# Altium project MC3_r2.PrjPcb (part 9 of 10)

## Sheet CanFaults.SchDoc
size Letter; Organization: Altium Limited; Address1: L3, 12a Rodborough Rd; Address2: Frenchs Forest; Address3: NSW; Address4: Australia 2086; DocumentNumber: D_3; SheetNumber: 3; SheetTotal: 21
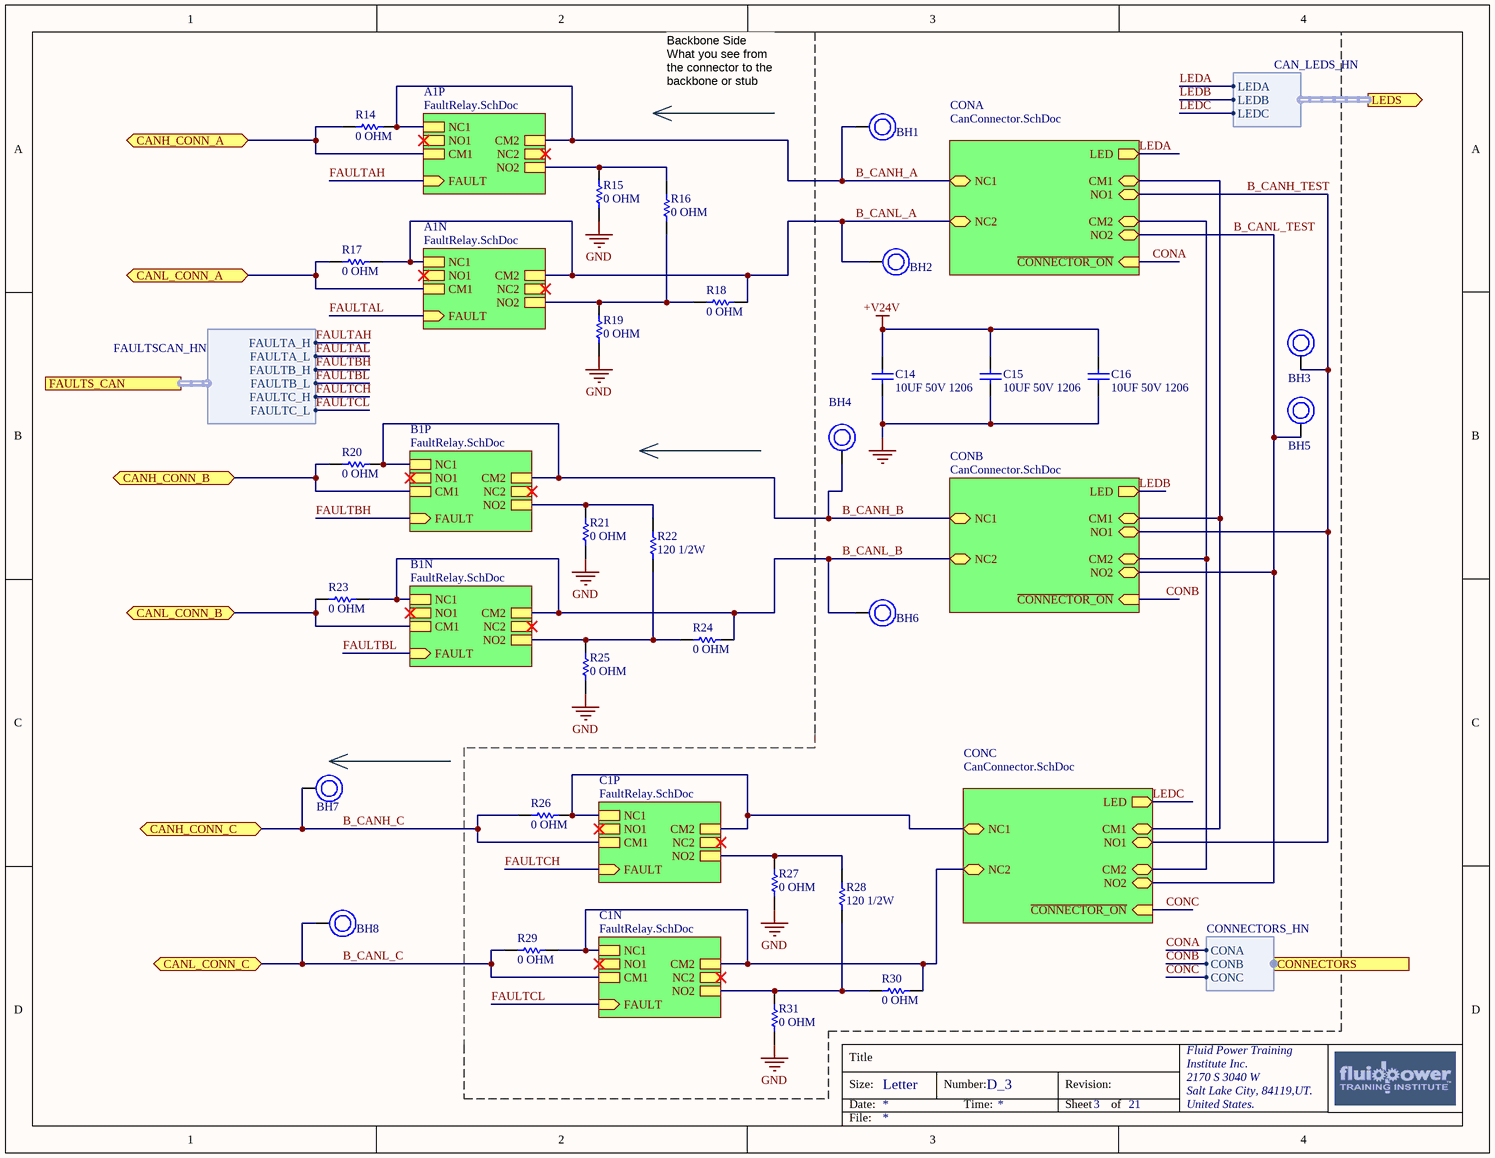
[diagram p15: CanFaults.SchDoc]

### Parts
BH1  BananaHole  [BananaHole]  (value not drawn)  (no BOM)
BH2  BananaHole  [BananaHole]  (value not drawn)  (no BOM)
BH3  BananaHole  [BananaHole]  (value not drawn)  (no BOM)
BH4  BananaHole  [BananaHole]  (value not drawn)  (no BOM)
BH5  BananaHole  [BananaHole]  (value not drawn)  (no BOM)
BH6  BananaHole  [BananaHole]  (value not drawn)  (no BOM)
BH7  BananaHole  [BananaHole]  (value not drawn)  (no BOM)
BH8  BananaHole  [BananaHole]  (value not drawn)  (no BOM)
C14  10UF 50V 1206  [CAPC3216X180X20ML20]
C15  10UF 50V 1206  [CAPC3216X180X20ML20]
C16  10UF 50V 1206  [CAPC3216X180X20ML20]
R14  0 OHM  [R0805]
R15  0 OHM  [R0805]
R16  0 OHM  [R0805]
R17  0 OHM  [R0805]
R18  0 OHM  [R0805]
R19  0 OHM  [R0805]
R20  0 OHM  [R0805]
R21  0 OHM  [R0805]
R22  120 1/2W  [RESC3225X60X45NL20T20]
R23  0 OHM  [R0805]
R24  0 OHM  [R0805]
R25  0 OHM  [R0805]
R26  0 OHM  [R0805]
R27  0 OHM  [R0805]
R28  120 1/2W  [RESC3225X60X45NL20T20]
R29  0 OHM  [R0805]
R30  0 OHM  [R0805]
R31  0 OHM  [R0805]

### Sub-sheets
A1N = FaultRelay.SchDoc: NC2, NO1, NC1, FAULT (in), NO2, CM1, CM2
A1P = FaultRelay.SchDoc: NC2, NO1, NC1, FAULT (in), NO2, CM1, CM2
B1N = FaultRelay.SchDoc: NC2, NO1, NC1, FAULT (in), NO2, CM1, CM2
B1P = FaultRelay.SchDoc: NC2, NO1, NC1, FAULT (in), NO2, CM1, CM2
C1N = FaultRelay.SchDoc: NC2, NO1, NC1, FAULT (in), NO2, CM1, CM2
C1P = FaultRelay.SchDoc: NC2, NO1, NC1, FAULT (in), NO2, CM1, CM2
CONA = CanConnector.SchDoc: CM2 (bidir), CM1 (bidir), NO2 (bidir), NO1 (bidir), NC2 (bidir), NC1 (bidir), ~{CONNECTOR_ON} (in), LED (out)
CONB = CanConnector.SchDoc: CM2 (bidir), CM1 (bidir), NO2 (bidir), NO1 (bidir), NC2 (bidir), NC1 (bidir), ~{CONNECTOR_ON} (in), LED (out)
CONC = CanConnector.SchDoc: CM2 (bidir), CM1 (bidir), NO2 (bidir), NO1 (bidir), NC2 (bidir), NC1 (bidir), ~{CONNECTOR_ON} (in), LED (out)

### Ports
CANH_CONN_A (bidir), CANH_CONN_B (bidir), CANH_CONN_C (bidir), CANL_CONN_A (bidir), CANL_CONN_B (bidir), CANL_CONN_C (bidir), CONNECTORS (harness CONNECTORS_HN), FAULTS_CAN (harness FAULTSCAN_HN), LEDS (out, harness CAN_LEDS_HN)

### Harnesses
FAULTSCAN_HN: FAULTA_H, FAULTA_L, FAULTB_H, FAULTB_L, FAULTC_H, FAULTC_L
CONNECTORS_HN: CONA, CONB, CONC
CAN_LEDS_HN: LEDA, LEDB, LEDC

### Nets
+V24V: C14.2 C15.2 C16.2
GND: C14.1 C15.1 C16.1 R15.1 R19.1 R21.1 R25.1 R27.1 R31.1
B_CANH_A: BH1.1 R14.2 ; sheet A1P/NC1, sheet A1P/CM2, sheet CONA/NC1
B_CANH_B: BH4.1 R20.2 ; sheet B1P/NC1, sheet B1P/CM2, sheet CONB/NC1
B_CANH_C: BH7.1 R26.1 ; port CANH_CONN_C, sheet C1P/CM1  [project net MC2_MC3_CANH]
B_CANH_TEST: BH3.1 ; sheet CONA/NO1, sheet CONB/NO1, sheet CONC/NO1
B_CANL_A: BH2.1 R17.2 R18.1 ; sheet A1N/NC1, sheet A1N/CM2, sheet CONA/NC2
B_CANL_B: BH6.1 R23.2 R24.1 ; sheet B1N/NC1, sheet B1N/CM2, sheet CONB/NC2
B_CANL_C: BH8.1 R29.1 ; port CANL_CONN_C, sheet C1N/CM1  [project net MC2_MC3_CANL]
B_CANL_TEST: BH5.1 ; sheet CONA/NO2, sheet CONB/NO2, sheet CONC/NO2
CONA: sheet CONA/~{CONNECTOR_ON}, port CONNECTORS.CONA
CONB: sheet CONB/~{CONNECTOR_ON}, port CONNECTORS.CONB
CONC: sheet CONC/~{CONNECTOR_ON}, port CONNECTORS.CONC
FAULTAH: sheet A1P/FAULT, port FAULTS_CAN.FAULTA_H
FAULTAL: sheet A1N/FAULT, port FAULTS_CAN.FAULTA_L
FAULTBH: sheet B1P/FAULT, port FAULTS_CAN.FAULTB_H
FAULTBL: sheet B1N/FAULT, port FAULTS_CAN.FAULTB_L
FAULTCH: sheet C1P/FAULT, port FAULTS_CAN.FAULTC_H
FAULTCL: sheet C1N/FAULT, port FAULTS_CAN.FAULTC_L
LEDA: sheet CONA/LED, port LEDS.LEDA
LEDB: sheet CONB/LED, port LEDS.LEDB
LEDC: sheet CONC/LED, port LEDS.LEDC
TESTCONNECTOR_CANH: R14.1 ; port CANH_CONN_A, sheet A1P/CM1
TESTCONNECTOR_CANL: R17.1 ; port CANL_CONN_A, sheet A1N/CM1
NetBH35_1: R20.1 ; port CANH_CONN_B, sheet B1P/CM1
NetBH39_1: R23.1 ; port CANL_CONN_B, sheet B1N/CM1
NetR15_2: R15.2 R16.2 ; sheet A1P/NO2
NetR16_1: R16.1 R18.2 R19.2 ; sheet A1N/NO2
NetR21_2: R21.2 R22.2 ; sheet B1P/NO2
NetR22_1: R22.1 R24.2 R25.2 ; sheet B1N/NO2
NetR26_2: R26.2 ; sheet C1P/NC1, sheet C1P/CM2, sheet CONC/NC1
NetR27_2: R27.2 R28.2 ; sheet C1P/NO2
NetR28_1: R28.1 R30.2 R31.2 ; sheet C1N/NO2
NetR29_2: R29.2 R30.1 ; sheet C1N/NC1, sheet C1N/CM2, sheet CONC/NC2
NetRL1_CONA_3: sheet CONA/CM1, sheet CONB/CM1, sheet CONC/CM1
NetRL1_CONA_6: sheet CONA/CM2, sheet CONB/CM2, sheet CONC/CM2

### Notes on the sheet
- Backbone Side
  What you see from the connector to the backbone or stub
- Title
- Size:
- Date:
- Letter
- Number:
- Time:
- Revision:
- Sheet
- of
- Fluid Power Training
- Institute Inc.
- 2170 S 3040 W
- Salt Lake City, 84119,UT.
- United States.
- File:

### Library data of the parts
BH1-BH8 = BananaHole: as BH9-BH32 on sheet MC_Connector
C14-C16 = C3216X5R1H106K160AB: CAP CER 10UF 50V X5R 1206; Manufacturer: TDK; Dielectric Material: Ceramic; Tolerance: 10%; Supplier 1: Mouser; Supplier Part Number 1: 810-C3216X5R1H106K; Manufacturer Part Number: C3216X5R1H106K160AB; RoHS: Yes; Category: Ceramic Capacitors; Stock 1: 145018; Pricing 1: 1=0.88000, 10=0.73100, 100=0.51800, 500=0.40900, 1000=0.35200, 2000=0.28700 (USD); Mount: Surface Mount; Case/Package: 1206; Weight: 0.000571oz; Case Code (Metric): 3216; Case Code (Imperial): 1206; Min Operating Temperature: -55°C; Max Operating Temperature: 85°C; Packaging: Tape and Reel; Capacitance: 10uF; Voltage Rating (DC): 50V; Dielectric: X5R; Package Quantity: 1; Voltage Rating: 50V; Termination: SMD/SMT; Voltage: 50V; Composition: Ceramic; Length: 3.2mm; Height: 1.6mm; Width: 0.063inch; Thickness: 0.071inch; Depth: 1.6mm; Radiation Hardening: No; REACH SVHC: No SVHC; Lead Free: Lead Free; ComponentLink1URL: https://datasheet.ciiva.com/24216/c3216x5r1h106k160ab-265364-24216574.pdf?src-supplier=Mouser; ComponentLink1Description: https://datasheet.ciiva.com/24216/c3216x5r1h106k160ab-265364-24216574.pdf?src-supplier=Mouser; ComponentLink2URL: https://datasheet.ciiva.com/6285/tdkmlcccaprange-6285895.pdf?src-supplier=Digi-Key; ComponentLink2Description: https://datasheet.ciiva.com/6285/tdkmlcccaprange-6285895.pdf?src-supplier=Digi-Key; ComponentLink3URL: https://datasheet.ciiva.com/24365/1865c3216x5r1h106k160ab-24365495.pdf?src-supplier=Onlinecomponents.com; ComponentLink3Description: https://datasheet.ciiva.com/24365/1865c3216x5r1h106k160ab-24365495.pdf?src-supplier=Onlinecomponents.com; ComponentLink4URL: https://datasheet.ciiva.com/22719/1796654-22719560.pdf?src-supplier=Element14; ComponentLink4Description: https://datasheet.ciiva.com/22719/1796654-22719560.pdf?src-supplier=Element14; ComponentLink5URL: https://datasheet.ciiva.com/28659/mlcc-commercial-general-en-28659437.pdf?src-supplier=Element14; ComponentLink5Description: https://datasheet.ciiva.com/28659/mlcc-commercial-general-en-28659437.pdf?src-supplier=Element14; ComponentLink6URL: https://datasheet.ciiva.com/17487/e412-c-17487294.pdf?src-supplier=Avnet+Europe; ComponentLink6Description: https://datasheet.ciiva.com/17487/e412-c-17487294.pdf?src-supplier=Avnet+Europe; ComponentLink7URL: https://datasheet.ciiva.com/6285/tdkmlcccaprange-6285893.pdf?src-supplier=Digi-Key; ComponentLink7Description: https://datasheet.ciiva.com/6285/tdkmlcccaprange-6285893.pdf?src-supplier=Digi-Key; ComponentLink8URL: https://datasheet.ciiva.com/22725/1913358-22725589.pdf?src-supplier=Element14; ComponentLink8Description: https://datasheet.ciiva.com/22725/1913358-22725589.pdf?src-supplier=Element14; ComponentLink9URL: https://datasheet.ciiva.com/23803/1796654-23803045.pdf?src-supplier=Newark; ComponentLink9Description: https://datasheet.ciiva.com/23803/1796654-23803045.pdf?src-supplier=Newark; ComponentLink10URL: https://datasheet.ciiva.com/28452/1796654-28452010.pdf?src-supplier=Element14; ComponentLink10Description: https://datasheet.ciiva.com/28452/1796654-28452010.pdf?src-supplier=Element14
R14 R15 R17-R21 R23-R27 R29-R31 = RK73Z2ATTD: Res Thick Film 0805 0 Ohm Pad SMD Automotive T/R; Manufacturer: KOA Speer; Resistance: 0mR; Tolerance: 1%; Power Rating: 2W; Temperature Coefficient: 400ppm/°C; Supplier 1: Mouser; Supplier Part Number 1: 660-RK73Z2ATTD; Manufacturer Part Number: RK73Z2ATTD; RoHS: Yes; Category: Chip SMD Resistors; Stock 1: 381276; Pricing 1: 1=0.10000, 10=0.09500, 100=0.09500, 1000=0.09500, 5000=0.00500, 10000=0.00400 (USD); Case/Package: 0805; Case Code (Imperial): 0805; Case Code (Metric): 2012; Min Operating Temperature: -55°C; Max Operating Temperature: 155°C; Packaging: Tape and Reel; Composition: Thick Film; Package Quantity: 5000; Termination: SMD/SMT; Military Standard: Not; Length: 2mm; Height: 0.5mm; Width: 1.25mm; Depth: 1.25mm; Lead Free: Lead Free; REACH SVHC: Unknown; ComponentLink1URL: https://datasheet.ciiva.com/7816/549012-7816885.pdf?src-supplier=Element14; ComponentLink1Description: https://datasheet.ciiva.com/7816/549012-7816885.pdf?src-supplier=Element14; ComponentLink2URL: https://datasheet.ciiva.com/15159/getdatasheetpartid-91633-15159914.pdf?src-supplier=Verical; ComponentLink2Description: https://datasheet.ciiva.com/15159/getdatasheetpartid-91633-15159914.pdf?src-supplier=Verical; ComponentLink3URL: https://datasheet.ciiva.com/48463/rk73z-series-eng-jap-tds-48463436.pdf?src-supplier=Distrelec; ComponentLink3Description: https://datasheet.ciiva.com/48463/rk73z-series-eng-jap-tds-48463436.pdf?src-supplier=Distrelec
R16 = RK73Z2ATTD: Res Thick Film 0805 0 Ohm Pad SMD Automotive T/R; Manufacturer: KOA Speer; Resistance: 0mR; Tolerance: 1%; Temperature Coefficient: 400ppm/°C; Power Rating: 2W; Supplier 1: Mouser; Supplier Part Number 1: 660-RK73Z2ATTD; Manufacturer Part Number: RK73Z2ATTD; RoHS: Yes; Category: Chip SMD Resistors; Stock 1: 381276; Pricing 1: 1=0.10000, 10=0.09500, 100=0.09500, 1000=0.09500, 5000=0.00500, 10000=0.00400 (USD); Case/Package: 0805; Case Code (Metric): 2012; Case Code (Imperial): 0805; Min Operating Temperature: -55°C; Max Operating Temperature: 155°C; Packaging: Tape and Reel; Package Quantity: 5000; Composition: Thick Film; Termination: SMD/SMT; Military Standard: Not; Length: 2mm; Height: 0.5mm; Width: 1.25mm; Depth: 1.25mm; Lead Free: Lead Free; REACH SVHC: Unknown; ComponentLink1URL: https://datasheet.ciiva.com/7816/549012-7816885.pdf?src-supplier=Element14; ComponentLink1Description: https://datasheet.ciiva.com/7816/549012-7816885.pdf?src-supplier=Element14; ComponentLink2URL: https://datasheet.ciiva.com/15159/getdatasheetpartid-91633-15159914.pdf?src-supplier=Verical; ComponentLink2Description: https://datasheet.ciiva.com/15159/getdatasheetpartid-91633-15159914.pdf?src-supplier=Verical; ComponentLink3URL: https://datasheet.ciiva.com/48463/rk73z-series-eng-jap-tds-48463436.pdf?src-supplier=Distrelec; ComponentLink3Description: https://datasheet.ciiva.com/48463/rk73z-series-eng-jap-tds-48463436.pdf?src-supplier=Distrelec
R22 R28 = CRCW1210120RFKEA: Thick Film Resistors - SMD 1/2watt 120ohms 1%; Manufacturer: Vishay; Resistance: 120R; Temperature Coefficient: 100ppm/°C; Power Rating: 500mW; Voltage Rating: 200V; Supplier 1: Mouser; Supplier Part Number 1: 71-CRCW1210F-120-E3; Manufacturer Part Number: CRCW1210120RFKEA; RoHS: Yes; Category: Chip SMD Resistors; Stock 1: 16273; Pricing 1: 1=0.25000, 10=0.21500, 100=0.08400, 1000=0.03200, 5000=0.02600, 10000=0.02400 (USD); Case/Package: 1210; Weight: 0.000564oz; Case Code (Metric): 3225; Case Code (Imperial): 1210; Contact Plating: Tin; Min Operating Temperature: -55°C; Max Operating Temperature: 155°C; Tolerance: 1%; Packaging: Tape and Reel; Package Quantity: 1; Composition: Thick Film; Voltage Rating (DC): 200V; Number of Terminations: 2; Max Power Dissipation: 500mW; Termination: SMD/SMT; Military Standard: Not; Features: Automotive AEC-Q200; Length: 3.2mm; Height: 0.024inch; Width: 0.098inch; Depth: 2.5mm; Radiation Hardening: No; Lead Free: Lead Free; REACH SVHC: Unknown; ComponentLink1URL: https://datasheet.ciiva.com/8899/dcrcwe3-8899640.pdf?src-supplier=Avnet; ComponentLink1Description: https://datasheet.ciiva.com/8899/dcrcwe3-8899640.pdf?src-supplier=Avnet; ComponentLink2URL: https://datasheet.ciiva.com/7777/1697337-7777595.pdf?src-supplier=Element14; ComponentLink2Description: https://datasheet.ciiva.com/7777/1697337-7777595.pdf?src-supplier=Element14; ComponentLink3URL: https://datasheet.ciiva.com/8897/dcrcwe3-8897165.pdf?src-supplier=Avnet; ComponentLink3Description: https://datasheet.ciiva.com/8897/dcrcwe3-8897165.pdf?src-supplier=Avnet; ComponentLink4URL: https://datasheet.ciiva.com/5549/dcrcwe3-109170-5549774.pdf?src-supplier=Mouser; ComponentLink4Description: https://datasheet.ciiva.com/5549/dcrcwe3-109170-5549774.pdf?src-supplier=Mouser

## Sheet FaultRelay.SchDoc
size Letter; Organization: Altium Limited; Address1: L3, 12a Rodborough Rd; Address2: Frenchs Forest; Address3: NSW; Address4: Australia 2086; DocumentNumber: D_8; SheetNumber: 8; SheetTotal: 21
Used 6 times, as channels U_MC3_blocks/U_CanFaults/A1P, U_MC3_blocks/U_CanFaults/A1N, U_MC3_blocks/U_CanFaults/B1P, U_MC3_blocks/U_CanFaults/B1N, U_MC3_blocks/U_CanFaults/C1P, U_MC3_blocks/U_CanFaults/C1N. Parts and nets are listed once, with the designators drawn on the sheet.
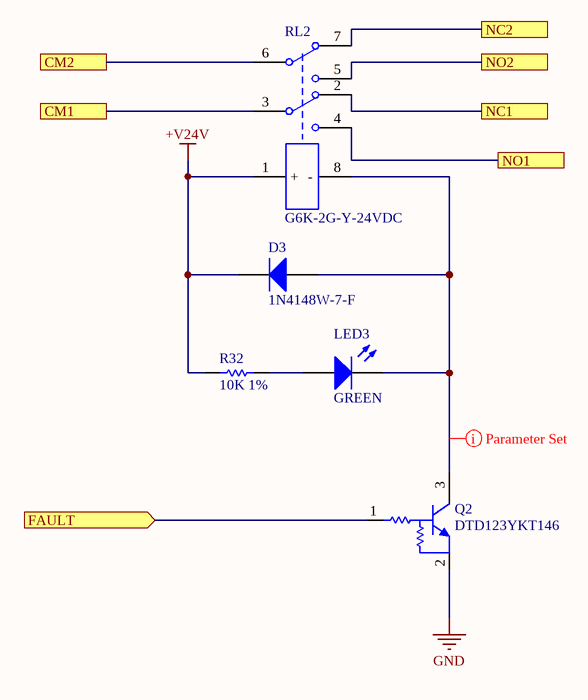
[diagram p16: FaultRelay.SchDoc]

### Parts
D3  1N4148W-7-F  [DIOD-SOD123-2_V]
LED3  GREEN  [LED0805]
Q2  DTD123YKT146  [SOT95P280X130-3N]
R32  10K 1%  [R0805]
RL2  G6K-2G-Y-24VDC  [G6K-2F-Y]

### Ports
CM1, CM2, FAULT (in), NC1, NC2, NO1, NO2

### Nets
+V24V: D3.2(K) R32.1 RL2.1(+)
GND: Q2.2(E)
CM1: RL2.3 ; port CM1
CM2: RL2.6 ; port CM2
FAULT: Q2.1(B) ; port FAULT
NC1: RL2.2 ; port NC1
NC2: RL2.7 ; port NC2
NO1: RL2.4 ; port NO1
NO2: RL2.5 ; port NO2
NetD3_1: D3.1(A) LED3.1(K) Q2.3(C) RL2.8(-)
NetLED3_2: LED3.2(A) R32.2

### Channels
U_MC3_blocks/U_CanFaults/A1P: designators end in _A1P; ports CM1=TESTCONNECTOR_CANH CM2=B_CANH_A FAULT=FAULTAH NC1=B_CANH_A NC2=NetRL2_A1P_7 NO1=NetRL2_A1P_4 NO2=NetR15_2
U_MC3_blocks/U_CanFaults/A1N: designators end in _A1N; ports CM1=TESTCONNECTOR_CANL CM2=B_CANL_A FAULT=FAULTAL NC1=B_CANL_A NC2=NetRL2_A1N_7 NO1=NetRL2_A1N_4 NO2=NetR16_1
U_MC3_blocks/U_CanFaults/B1P: designators end in _B1P; ports CM1=NetBH35_1 CM2=B_CANH_B FAULT=FAULTBH NC1=B_CANH_B NC2=NetRL2_B1P_7 NO1=NetRL2_B1P_4 NO2=NetR21_2
U_MC3_blocks/U_CanFaults/B1N: designators end in _B1N; ports CM1=NetBH39_1 CM2=B_CANL_B FAULT=FAULTBL NC1=B_CANL_B NC2=NetRL2_B1N_7 NO1=NetRL2_B1N_4 NO2=NetR22_1
U_MC3_blocks/U_CanFaults/C1P: designators end in _C1P; ports CM1=MC2_MC3_CANH CM2=NetR26_2 FAULT=FAULTCH NC1=NetR26_2 NC2=NetRL2_C1P_7 NO1=NetRL2_C1P_4 NO2=NetR27_2
U_MC3_blocks/U_CanFaults/C1N: designators end in _C1N; ports CM1=MC2_MC3_CANL CM2=NetR29_2 FAULT=FAULTCL NC1=NetR29_2 NC2=NetRL2_C1N_7 NO1=NetRL2_C1N_4 NO2=NetR28_1

### Layout directives
net class RELAY_DRIVER: NetD3_A1P_1

### Notes on the sheet
- Title
- Size:
- Date:
- Letter
- Number:
- Time:
- Revision:
- Sheet
- of
- Fluid Power Training
- Institute Inc.
- 2170 S 3040 W
- Salt Lake City, 84119,UT.
- United States.
- File:

### Library data of the parts
D3 = 1N4148W-7-F: DIODE GEN PURP 100V 300MA SOD123; Manufacturer: Diodes; Reverse Recovery Time: 4ns; Forward Voltage: 1.25V; Element Configuration: Single; Forward Current: 150mA; Peak Non-Repetitive Surge Current: 2A; Power Dissipation: 400mW; Peak Reverse Current: 1uA; Polarity: Standard; Voltage Rating (DC): 75V; Capacitance: 2pF; Current: 15A; Supplier 1: Mouser; Supplier Part Number 1: 621-1N4148W-F; Manufacturer Part Number: 1N4148W-7-F; RoHS: Yes; Category: Rectifier Diodes; Stock 1: 1274151; Pricing 1: 1=0.16000, 10=0.15000, 100=0.05300, 1000=0.03500, 3000=0.02700, 9000=0.02400 (USD); Mount: Surface Mount; Number of Pins: 2; Weight: 0.000353oz; Contact Plating: Tin,Matte; Min Operating Temperature: -65°C; Max Operating Temperature: 150°C; Packaging: Tape and Reel; Max Repetitive Reverse Voltage (Vrrm): 100V; Package Quantity: 3000; Average Rectified Current: 300mA; Max Reverse Voltage (DC): 100V; Recovery Time: 4ns; Max Forward Surge Current (Ifsm): 2A; Max Surge Current: 2A; Current Rating: 150mA; Output Current: 150mA; Voltage: 100V; Power Rating: 400mW; Length: 2.85mm; Height: 1.25mm; Width: 1.7mm; Radiation Hardening: No; Lead Free: Lead Free; REACH SVHC: No SVHC; ComponentLink1URL: https://datasheet.ciiva.com/4435/ds30086-4435128.pdf?src-supplier=Mouser; ComponentLink1Description: https://datasheet.ciiva.com/4435/ds30086-4435128.pdf?src-supplier=Mouser; ComponentLink2URL: https://datasheet.ciiva.com/8300/ds30086-8300392.pdf?src-supplier=Avnet; ComponentLink2Description: https://datasheet.ciiva.com/8300/ds30086-8300392.pdf?src-supplier=Avnet; ComponentLink3URL: https://datasheet.ciiva.com/911/ds30086-911734.pdf?src-supplier=Digi-Key; ComponentLink3Description: https://datasheet.ciiva.com/911/ds30086-911734.pdf?src-supplier=Digi-Key; ComponentLink4URL: https://datasheet.ciiva.com/911/ds30086-911735.pdf?src-supplier=Digi-Key; ComponentLink4Description: https://datasheet.ciiva.com/911/ds30086-911735.pdf?src-supplier=Digi-Key; ComponentLink5URL: https://datasheet.ciiva.com/22695/1915529-22695239.pdf?src-supplier=Element14; ComponentLink5Description: https://datasheet.ciiva.com/22695/1915529-22695239.pdf?src-supplier=Element14; ComponentLink6URL: https://datasheet.ciiva.com/911/ds30086-911736.pdf?src-supplier=Digi-Key; ComponentLink6Description: https://datasheet.ciiva.com/911/ds30086-911736.pdf?src-supplier=Digi-Key; ComponentLink7URL: https://datasheet.ciiva.com/1179/1915529-1179304.pdf?src-supplier=Element14; ComponentLink7Description: https://datasheet.ciiva.com/1179/1915529-1179304.pdf?src-supplier=Element14; ComponentLink8URL: https://datasheet.ciiva.com/25919/ds30086-25919609.pdf?src-supplier=Avnet+Europe; ComponentLink8Description: https://datasheet.ciiva.com/25919/ds30086-25919609.pdf?src-supplier=Avnet+Europe; ComponentLink9URL: https://datasheet.ciiva.com/15219/getdatasheetpartid-110030-15219548.pdf?src-supplier=Verical; ComponentLink9Description: https://datasheet.ciiva.com/15219/getdatasheetpartid-110030-15219548.pdf?src-supplier=Verical; ComponentLink10URL: https://datasheet.ciiva.com/8303/ds30086-8303197.pdf?src-supplier=Avnet; ComponentLink10Description: https://datasheet.ciiva.com/8303/ds30086-8303197.pdf?src-supplier=Avnet
LED3 = 150080VS75000: LED GREEN CLEAR 0805 SMD; Manufacturer: Wurth Electronics; Viewing Angle: 140°; Lens Style: Clear,Rectangular; Forward Voltage: 2V; Luminous Intensity: 40mcd; Dominant Wavelength: 570nm; Forward Current: 30mA; Test Current: 20mA; Supplier 1: Mouser; Supplier Part Number 1: 710-150080VS75000; Manufacturer Part Number: 150080VS75000; RoHS: Yes; Category: LEDs; Stock 1: 16574; Pricing 1: 1=0.18000, 10=0.17500, 25=0.17400, 50=0.16200, 100=0.13900, 250=0.12300 (USD); Mount: Surface Mount; Case/Package: 0805; Color: Green; Case Code (Metric): 2012; Case Code (Imperial): 0805; Min Operating Temperature: -40°C; Max Operating Temperature: 85°C; Packaging: Tape and Reel; Package Quantity: 4000; Wavelength: 570nm; Length: 2mm; Height: 0.7mm; Width: 1.25mm; REACH SVHC: Unknown; ComponentLink1URL: https://datasheet.ciiva.com/22656/150080vs75000-22656966.pdf?src-supplier=Element14; ComponentLink1Description: https://datasheet.ciiva.com/22656/150080vs75000-22656966.pdf?src-supplier=Element14; ComponentLink2URL: https://datasheet.ciiva.com/29279/759437-da-01-en-chipled-0805-w-kl-h-gruen-150080vs7500-29279047.pdf?src-supplier=Conrad; ComponentLink2Description: https://datasheet.ciiva.com/29279/759437-da-01-en-chipled-0805-w-kl-h-gruen-150080vs7500-29279047.pdf?src-supplier=Conrad; ComponentLink3URL: https://datasheet.ciiva.com/29563/150080vs75000-29563018.pdf?src-supplier=Digi-Key; ComponentLink3Description: https://datasheet.ciiva.com/29563/150080vs75000-29563018.pdf?src-supplier=Digi-Key
Q2 = DTD123YKT146: TRANS PREBIAS NPN 200MW SMT3; Manufacturer: Rohm; Collector Emitter Voltage (VCEO): 300mV; Element Configuration: Single; hFE Min: 56; Max Collector Current: 500mA; Collector Emitter Breakdown Voltage: 50V; Transition Frequency: 200MHz; Supplier 1: Mouser; Supplier Part Number 1: 755-DTD123YKT146; Manufacturer Part Number: DTD123YKT146; RoHS: Yes; Category: BJTs; Stock 1: 8666; Pricing 1: 1=0.38000, 10=0.28800, 100=0.15600, 1000=0.11700, 3000=0.10100, 9000=0.09500 (USD); Mount: Surface Mount; Case/Package: SMD/SMT; Number of Pins: 3; Min Operating Temperature: -55°C; Max Operating Temperature: 150°C; Packaging: Tape and Reel; Package Quantity: 1; Max Power Dissipation: 200mW; Polarity: NPN; Power Dissipation: 200mW; Max Breakdown Voltage: 50V; Voltage Rating (DC): 50V; Current Rating: 500mA; Termination: SMD/SMT; Max Output Current: 500mA; Operating Supply Voltage: 50V; Continuous Collector Current: 500mA; Length: 2.9mm; Height: 1.1mm; Width: 1.6mm; Radiation Hardening: No; REACH SVHC: No SVHC; Lead Free: Lead Free; ComponentLink1URL: https://datasheet.ciiva.com/6356/dtd123yk-6356016.pdf?src-supplier=Digi-Key; ComponentLink1Description: https://datasheet.ciiva.com/6356/dtd123yk-6356016.pdf?src-supplier=Digi-Key; ComponentLink2URL: https://datasheet.ciiva.com/16616/dtd123yk-16616256.pdf?src-supplier=Avnet+Europe; ComponentLink2Description: https://datasheet.ciiva.com/16616/dtd123yk-16616256.pdf?src-supplier=Avnet+Europe; ComponentLink3URL: https://datasheet.ciiva.com/5782/1645233-5782035.pdf?src-supplier=Farnell; ComponentLink3Description: https://datasheet.ciiva.com/5782/1645233-5782035.pdf?src-supplier=Farnell; ComponentLink4URL: https://datasheet.ciiva.com/16953/0900766b8101ddb2-16953270.pdf?src-supplier=Allied+Electronics; ComponentLink4Description: https://datasheet.ciiva.com/16953/0900766b8101ddb2-16953270.pdf?src-supplier=Allied+Electronics; ComponentLink5URL: https://datasheet.ciiva.com/12316/dtd123yk-210516-12316106.pdf?src-supplier=Mouser; ComponentLink5Description: https://datasheet.ciiva.com/12316/dtd123yk-210516-12316106.pdf?src-supplier=Mouser; ComponentLink6URL: https://datasheet.ciiva.com/8029/1645233-8029419.pdf?src-supplier=Element14; ComponentLink6Description: https://datasheet.ciiva.com/8029/1645233-8029419.pdf?src-supplier=Element14; ComponentLink7URL: https://datasheet.ciiva.com/11210/dtd123yk-11210380.pdf?src-supplier=Avnet; ComponentLink7Description: https://datasheet.ciiva.com/11210/dtd123yk-11210380.pdf?src-supplier=Avnet
R32 = CRCW080510K0FKEA: VISHAY - CRCW080510K0FKEA - SMD Chip Resistor, 0805 [2012 Metric], 10 kohm, CRCW e3 Series, 150 V, Thick Film, 125 mW; Resistance: 10kR; Temperature Coefficient: 100ppm/°C; Power Rating: 125mW; Voltage Rating: 150V; Supplier 1: Mouser; Manufacturer: Vishay; Manufacturer Part Number: CRCW080510K0FKEA; RoHS: Yes; Stock 1: 1138857; Pricing 1: 1=0.10000, 10=0.06200, 100=0.02500, 1000=0.01000, 5000=0.00700, 10000=0.00600 (USD); ComponentLink1URL: https://datasheet.ciiva.com/11808/0900766b80d98b26-11808216.pdf?src-supplier=RSComponents; ComponentLink1Description: https://datasheet.ciiva.com/11808/0900766b80d98b26-11808216.pdf?src-supplier=RSComponents; ComponentLink2URL: https://datasheet.ciiva.com/5547/dcrcwe3-109170-5547559.pdf?src-supplier=Mouser; ComponentLink2Description: https://datasheet.ciiva.com/5547/dcrcwe3-109170-5547559.pdf?src-supplier=Mouser; Supplier Part Number 1: 71-CRCW0805-10K-E3; Category: Chip SMD Resistors; Case/Package: 0805; Weight: 0.000194oz; Case Code (Imperial): 0805; Case Code (Metric): 2012; Contact Plating: Tin; Min Operating Temperature: -55°C; Max Operating Temperature: 155°C; Tolerance: 1%; Packaging: Tape and Reel; Composition: Thick Film; Termination: SMD/SMT; Voltage Rating (DC): 150V; Package Quantity: 5000; Military Standard: Not; Length: 2mm; Height: 0.45mm; Width: 1.25mm; Depth: 1.25mm; Radiation Hardening: No; Lead Free: Lead Free; REACH SVHC: Unknown; ComponentLink3URL: https://datasheet.ciiva.com/16719/70201119-16719082.pdf?src-supplier=Allied+Electronics; ComponentLink3Description: https://datasheet.ciiva.com/16719/70201119-16719082.pdf?src-supplier=Allied+Electronics; ComponentLink4URL: https://datasheet.ciiva.com/16883/dcrcwe3-16883708.pdf?src-supplier=Avnet+Europe; ComponentLink4Description: https://datasheet.ciiva.com/16883/dcrcwe3-16883708.pdf?src-supplier=Avnet+Europe; ComponentLink5URL: https://datasheet.ciiva.com/8337/dcrcwe3-8337773.pdf?src-supplier=Avnet; ComponentLink5Description: https://datasheet.ciiva.com/8337/dcrcwe3-8337773.pdf?src-supplier=Avnet; ComponentLink6URL: https://datasheet.ciiva.com/46394/1720486-46394381.pdf?src-supplier=Element14; ComponentLink6Description: https://datasheet.ciiva.com/46394/1720486-46394381.pdf?src-supplier=Element14; ComponentLink7URL: https://datasheet.ciiva.com/16199/dcrcwe3-16199086.pdf?src-supplier=Future+Electronics; ComponentLink7Description: https://datasheet.ciiva.com/16199/dcrcwe3-16199086.pdf?src-supplier=Future+Electronics; ComponentLink8URL: https://datasheet.ciiva.com/16514/dcrcwe3-16514907.pdf?src-supplier=Avnet+Asia; ComponentLink8Description: https://datasheet.ciiva.com/16514/dcrcwe3-16514907.pdf?src-supplier=Avnet+Asia; ComponentLink9URL: https://datasheet.ciiva.com/16755/70201119-16755389.pdf?src-supplier=Allied+Electronics; ComponentLink9Description: https://datasheet.ciiva.com/16755/70201119-16755389.pdf?src-supplier=Allied+Electronics; ComponentLink10URL: https://datasheet.ciiva.com/8337/dcrcwe3-8337774.pdf?src-supplier=Avnet; ComponentLink10Description: https://datasheet.ciiva.com/8337/dcrcwe3-8337774.pdf?src-supplier=Avnet
RL2 = G6K-2G-Y-24VDC: Electromechanical Relay DPDT 1A 24VDC 5.22KOhm Surface Mount; Manufacturer: Omron; Manufacturer Part Number: G6K-2F-YDC24; Coil Current: 4.6mA; Coil Resistance: 5.22kR; Coil Voltage (DC): 24V; Max Voltage Rating (AC): 125V; Max Voltage Rating (DC): 60V; Operate Time: 3ms; Coil Type: Non-Latching; Relay Type: Telecom; Coil Power: 100mW; Supplier 1: Mouser; Supplier Part Number 1: 653-G6K-2F-Y-DC24; RoHS: Yes; Category: Signal Relays; Mount: Surface Mount; Number of Pins: 8; Weight: 0.024692oz; Contact Material: Gold,Silver; Min Operating Temperature: -40°C; Max Operating Temperature: 70°C; Packaging: Rail/Tube; Throw Configuration: DPDT; Max Current Rating: 1A; Contact Current Rating: 1A; Termination: Gull Wing; Package Quantity: 50; Release Time: 3ms; Power Consumption: 100mW; Voltage Rating (AC): 125V; Voltage Rating (DC): 60V; Length: 10mm; Depth: 7.8mm; Radiation Hardening: No; Lead Free: Lead Free; ComponentLink1URL: https://datasheet.ciiva.com/30066/81en-g6k-30066045.pdf?src-supplier=Onlinecomponents.com; ComponentLink1Description: https://datasheet.ciiva.com/30066/81en-g6k-30066045.pdf?src-supplier=Onlinecomponents.com

## Sheet CanConnector.SchDoc
size Letter; Organization: Altium Limited; Address1: L3, 12a Rodborough Rd; Address2: Frenchs Forest; Address3: NSW; Address4: Australia 2086; DocumentNumber: D_7; SheetNumber: 7; SheetTotal: 21
Used 3 times, as channels U_MC3_blocks/U_CanFaults/CONA, U_MC3_blocks/U_CanFaults/CONB, U_MC3_blocks/U_CanFaults/CONC. Parts and nets are listed once, with the designators drawn on the sheet.
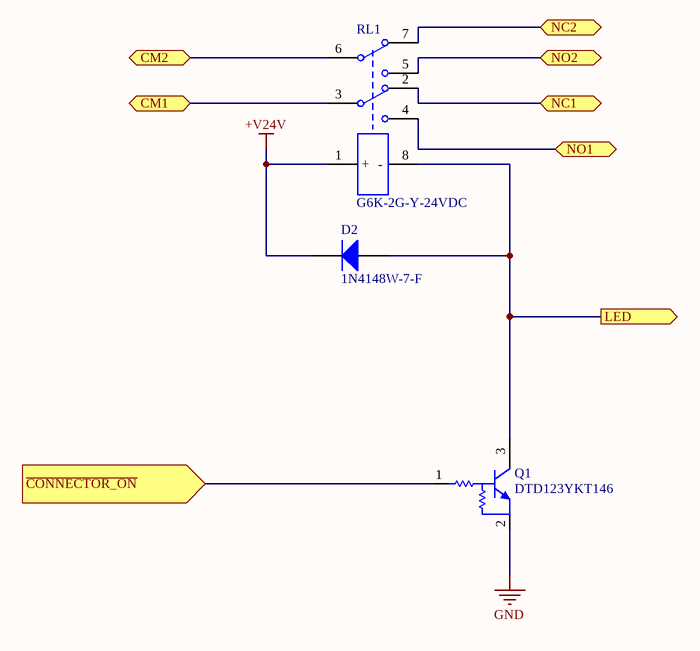
[diagram p17: CanConnector.SchDoc]

### Parts
D2  1N4148W-7-F  [DIOD-SOD123-2_V]
Q1  DTD123YKT146  [SOT95P280X130-3N]
RL1  G6K-2G-Y-24VDC  [G6K-2F-Y]

### Ports
CM1 (bidir), CM2 (bidir), LED (out), NC1 (bidir), NC2 (bidir), NO1 (bidir), NO2 (bidir), ~{CONNECTOR_ON} (in)

### Nets
+V24V: D2.2(K) RL1.1(+)
GND: Q1.2(E)
~{CONNECTOR_ON}: Q1.1(B) ; port ~{CONNECTOR_ON}
CM1: RL1.3 ; port CM1
CM2: RL1.6 ; port CM2
LED: D2.1(A) Q1.3(C) RL1.8(-) ; port LED
NC1: RL1.2 ; port NC1
NC2: RL1.7 ; port NC2
NO1: RL1.4 ; port NO1
NO2: RL1.5 ; port NO2

### Channels
U_MC3_blocks/U_CanFaults/CONA: designators end in _CONA; ports CM1=NetRL1_CONA_3 CM2=NetRL1_CONA_6 LED=LEDA NC1=B_CANH_A NC2=B_CANL_A NO1=B_CANH_TEST NO2=B_CANL_TEST ~{CONNECTOR_ON}=CONA
U_MC3_blocks/U_CanFaults/CONB: designators end in _CONB; ports CM1=NetRL1_CONA_3 CM2=NetRL1_CONA_6 LED=LEDB NC1=B_CANH_B NC2=B_CANL_B NO1=B_CANH_TEST NO2=B_CANL_TEST ~{CONNECTOR_ON}=CONB
U_MC3_blocks/U_CanFaults/CONC: designators end in _CONC; ports CM1=NetRL1_CONA_3 CM2=NetRL1_CONA_6 LED=LEDC NC1=NetR26_2 NC2=NetR29_2 NO1=B_CANH_TEST NO2=B_CANL_TEST ~{CONNECTOR_ON}=CONC

### Notes on the sheet
- Title
- Size:
- Date:
- Letter
- Number:
- Time:
- Revision:
- Sheet
- of
- Fluid Power Training
- Institute Inc.
- 2170 S 3040 W
- Salt Lake City, 84119,UT.
- United States.
- File:

### Library data of the parts
D2 = 1N4148W-7-F: as D3 on sheet FaultRelay; Supplier 1: Mouser; Supplier Part Number 1: 621-1N4148W-F; Manufacturer Part Number: 1N4148W-7-F; RoHS: Yes; Category: Rectifier Diodes; Stock 1: 1274151; Pricing 1: 1=0.16000, 10=0.15000, 100=0.05300, 1000=0.03500, 3000=0.02700, 9000=0.02400 (USD); Mount: Surface Mount; Number of Pins: 2; Weight: 0.000353oz; Contact Plating: Tin,Matte; Min Operating Temperature: -65°C; Max Operating Temperature: 150°C; Packaging: Tape and Reel; Max Repetitive Reverse Voltage (Vrrm): 100V; Package Quantity: 3000; Average Rectified Current: 300mA; Max Reverse Voltage (DC): 100V; Recovery Time: 4ns; Max Forward Surge Current (Ifsm): 2A; Max Surge Current: 2A; Current Rating: 150mA; Output Current: 150mA; Voltage: 100V; Power Rating: 400mW; Length: 2.85mm; Height: 1.25mm; Width: 1.7mm; Radiation Hardening: No; Lead Free: Lead Free; REACH SVHC: No SVHC; ComponentLink1URL: https://datasheet.ciiva.com/4435/ds30086-4435128.pdf?src-supplier=Mouser; ComponentLink1Description: https://datasheet.ciiva.com/4435/ds30086-4435128.pdf?src-supplier=Mouser; ComponentLink2URL: https://datasheet.ciiva.com/8300/ds30086-8300392.pdf?src-supplier=Avnet; ComponentLink2Description: https://datasheet.ciiva.com/8300/ds30086-8300392.pdf?src-supplier=Avnet; ComponentLink3URL: https://datasheet.ciiva.com/911/ds30086-911734.pdf?src-supplier=Digi-Key; ComponentLink3Description: https://datasheet.ciiva.com/911/ds30086-911734.pdf?src-supplier=Digi-Key; ComponentLink4URL: https://datasheet.ciiva.com/911/ds30086-911735.pdf?src-supplier=Digi-Key; ComponentLink4Description: https://datasheet.ciiva.com/911/ds30086-911735.pdf?src-supplier=Digi-Key; ComponentLink5URL: https://datasheet.ciiva.com/22695/1915529-22695239.pdf?src-supplier=Element14; ComponentLink5Description: https://datasheet.ciiva.com/22695/1915529-22695239.pdf?src-supplier=Element14; ComponentLink6URL: https://datasheet.ciiva.com/911/ds30086-911736.pdf?src-supplier=Digi-Key; ComponentLink6Description: https://datasheet.ciiva.com/911/ds30086-911736.pdf?src-supplier=Digi-Key; ComponentLink7URL: https://datasheet.ciiva.com/1179/1915529-1179304.pdf?src-supplier=Element14; ComponentLink7Description: https://datasheet.ciiva.com/1179/1915529-1179304.pdf?src-supplier=Element14; ComponentLink8URL: https://datasheet.ciiva.com/25919/ds30086-25919609.pdf?src-supplier=Avnet+Europe; ComponentLink8Description: https://datasheet.ciiva.com/25919/ds30086-25919609.pdf?src-supplier=Avnet+Europe; ComponentLink9URL: https://datasheet.ciiva.com/15219/getdatasheetpartid-110030-15219548.pdf?src-supplier=Verical; ComponentLink9Description: https://datasheet.ciiva.com/15219/getdatasheetpartid-110030-15219548.pdf?src-supplier=Verical; ComponentLink10URL: https://datasheet.ciiva.com/8303/ds30086-8303197.pdf?src-supplier=Avnet; ComponentLink10Description: https://datasheet.ciiva.com/8303/ds30086-8303197.pdf?src-supplier=Avnet
Q1 = DTD123YKT146: as Q2 on sheet FaultRelay; Supplier 1: Mouser; Supplier Part Number 1: 755-DTD123YKT146; Manufacturer Part Number: DTD123YKT146; RoHS: Yes; Category: BJTs; Stock 1: 8666; Pricing 1: 1=0.38000, 10=0.28800, 100=0.15600, 1000=0.11700, 3000=0.10100, 9000=0.09500 (USD); Mount: Surface Mount; Case/Package: SMD/SMT; Number of Pins: 3; Min Operating Temperature: -55°C; Max Operating Temperature: 150°C; Packaging: Tape and Reel; Package Quantity: 1; Max Power Dissipation: 200mW; Polarity: NPN; Power Dissipation: 200mW; Max Breakdown Voltage: 50V; Voltage Rating (DC): 50V; Current Rating: 500mA; Termination: SMD/SMT; Max Output Current: 500mA; Operating Supply Voltage: 50V; Continuous Collector Current: 500mA; Length: 2.9mm; Height: 1.1mm; Width: 1.6mm; Radiation Hardening: No; REACH SVHC: No SVHC; Lead Free: Lead Free; ComponentLink1URL: https://datasheet.ciiva.com/6356/dtd123yk-6356016.pdf?src-supplier=Digi-Key; ComponentLink1Description: https://datasheet.ciiva.com/6356/dtd123yk-6356016.pdf?src-supplier=Digi-Key; ComponentLink2URL: https://datasheet.ciiva.com/16616/dtd123yk-16616256.pdf?src-supplier=Avnet+Europe; ComponentLink2Description: https://datasheet.ciiva.com/16616/dtd123yk-16616256.pdf?src-supplier=Avnet+Europe; ComponentLink3URL: https://datasheet.ciiva.com/5782/1645233-5782035.pdf?src-supplier=Farnell; ComponentLink3Description: https://datasheet.ciiva.com/5782/1645233-5782035.pdf?src-supplier=Farnell; ComponentLink4URL: https://datasheet.ciiva.com/16953/0900766b8101ddb2-16953270.pdf?src-supplier=Allied+Electronics; ComponentLink4Description: https://datasheet.ciiva.com/16953/0900766b8101ddb2-16953270.pdf?src-supplier=Allied+Electronics; ComponentLink5URL: https://datasheet.ciiva.com/12316/dtd123yk-210516-12316106.pdf?src-supplier=Mouser; ComponentLink5Description: https://datasheet.ciiva.com/12316/dtd123yk-210516-12316106.pdf?src-supplier=Mouser; ComponentLink6URL: https://datasheet.ciiva.com/8029/1645233-8029419.pdf?src-supplier=Element14; ComponentLink6Description: https://datasheet.ciiva.com/8029/1645233-8029419.pdf?src-supplier=Element14; ComponentLink7URL: https://datasheet.ciiva.com/11210/dtd123yk-11210380.pdf?src-supplier=Avnet; ComponentLink7Description: https://datasheet.ciiva.com/11210/dtd123yk-11210380.pdf?src-supplier=Avnet
RL1 = G6K-2G-Y-24VDC: as RL2 on sheet FaultRelay; Supplier 1: Mouser; Supplier Part Number 1: 653-G6K-2F-Y-DC24; RoHS: Yes; Category: Signal Relays; Mount: Surface Mount; Number of Pins: 8; Weight: 0.024692oz; Contact Material: Gold,Silver; Min Operating Temperature: -40°C; Max Operating Temperature: 70°C; Packaging: Rail/Tube; Throw Configuration: DPDT; Max Current Rating: 1A; Contact Current Rating: 1A; Termination: Gull Wing; Package Quantity: 50; Release Time: 3ms; Power Consumption: 100mW; Voltage Rating (AC): 125V; Voltage Rating (DC): 60V; Length: 10mm; Depth: 7.8mm; Radiation Hardening: No; Lead Free: Lead Free; ComponentLink1URL: https://datasheet.ciiva.com/30066/81en-g6k-30066045.pdf?src-supplier=Onlinecomponents.com; ComponentLink1Description: https://datasheet.ciiva.com/30066/81en-g6k-30066045.pdf?src-supplier=Onlinecomponents.com

## Sheet Fault_Module.SchDoc
size Letter; Organization: Altium Limited; Address1: L3, 12a Rodborough Rd; Address2: Frenchs Forest; Address3: NSW; Address4: Australia 2086; DocumentNumber: D_4; SheetNumber: 4; SheetTotal: 21
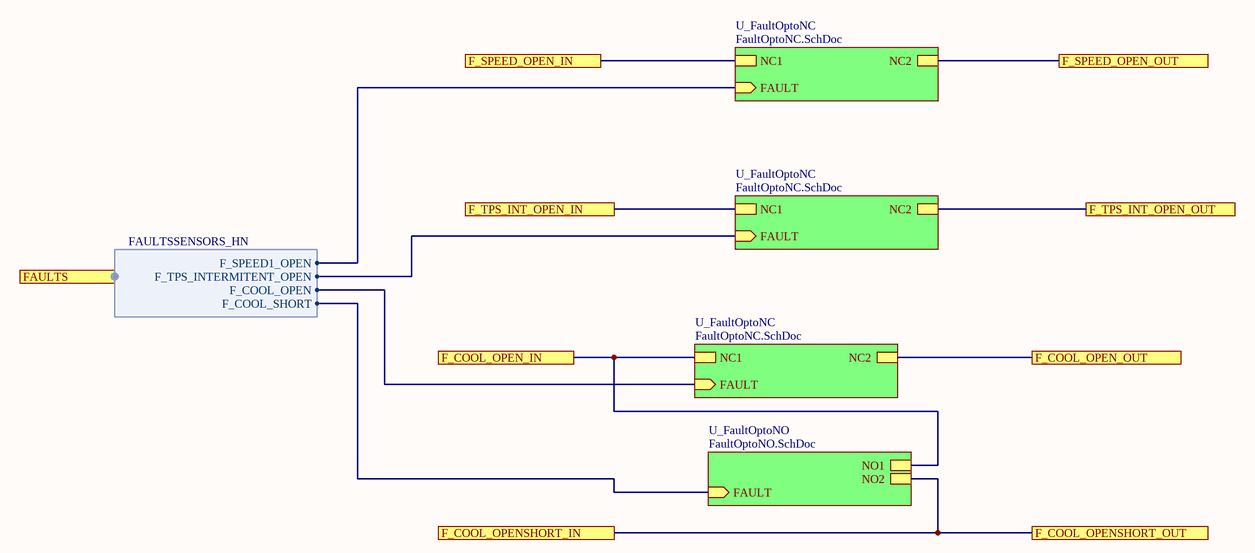
[diagram p18: Fault_Module.SchDoc]

### Sub-sheets
U_FaultOptoNC = FaultOptoNC.SchDoc: NC1, NC2, FAULT (in)
U_FaultOptoNC = FaultOptoNC.SchDoc: NC1, NC2, FAULT (in)
U_FaultOptoNC = FaultOptoNC.SchDoc: NC1, NC2, FAULT (in)
U_FaultOptoNO = FaultOptoNO.SchDoc: NO1, NO2, FAULT (in)

### Ports
F_COOL_OPEN_IN, F_COOL_OPEN_OUT, F_COOL_OPENSHORT_IN, F_COOL_OPENSHORT_OUT, F_SPEED_OPEN_IN, F_SPEED_OPEN_OUT, F_TPS_INT_OPEN_IN, F_TPS_INT_OPEN_OUT, FAULTS (harness FAULTSSENSORS_HN)

### Harnesses
FAULTSSENSORS_HN: F_SPEED1_OPEN, F_TPS_INTERMITENT_OPEN, F_COOL_OPEN, F_COOL_SHORT

### Nets
COOL_RET: port F_COOL_OPENSHORT_OUT, port F_COOL_OPENSHORT_IN, sheet U_FaultOptoNO/NO2
COOL_TEMP_IN: port F_COOL_OPEN_OUT, sheet U_FaultOptoNC/NC2
COOL_TEMP_INa: port F_COOL_OPEN_IN, sheet U_FaultOptoNC/NC1, sheet U_FaultOptoNO/NO1
F_Cool-Short: sheet U_FaultOptoNO/FAULT, port FAULTS.F_COOL_SHORT
F_Cool_Open: sheet U_FaultOptoNC/FAULT, port FAULTS.F_COOL_OPEN
F_Speed1_Open: sheet U_FaultOptoNC/FAULT, port FAULTS.F_SPEED1_OPEN
F_TPS_Intermitent: sheet U_FaultOptoNC/FAULT, port FAULTS.F_TPS_INTERMITENT_OPEN
SPEED1_IN: port F_SPEED_OPEN_OUT, sheet U_FaultOptoNC/NC2
SPEED1_INa: port F_SPEED_OPEN_IN, sheet U_FaultOptoNC/NC1
TPS_WIPER: port F_TPS_INT_OPEN_OUT, sheet U_FaultOptoNC/NC2
TPS_WIPERa: port F_TPS_INT_OPEN_IN, sheet U_FaultOptoNC/NC1

### Notes on the sheet
- Title
- Size:
- Date:
- Letter
- Number:
- Time:
- Revision:
- Sheet
- of
- Fluid Power Training
- Institute Inc.
- 2170 S 3040 W
- Salt Lake City, 84119,UT.
- United States.
- File:

## Sheet FaultOptoNC.SchDoc
size Letter; Organization: Altium Limited; Address1: L3, 12a Rodborough Rd; Address2: Frenchs Forest; Address3: NSW; Address4: Australia 2086; DocumentNumber: D_9; SheetNumber: 9; SheetTotal: 21
Used 3 times, as channels U_MC3_blocks/U_Fault_Module/U_FaultOptoNC, U_MC3_blocks/U_Fault_Module/U_FaultOptoNC, U_MC3_blocks/U_Fault_Module/U_FaultOptoNC. Parts and nets are listed once, with the designators drawn on the sheet.
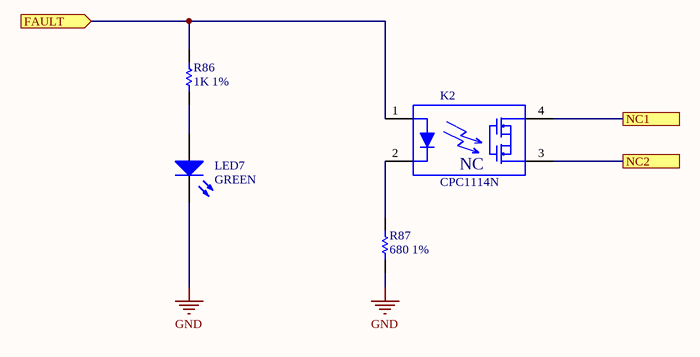
[diagram p19: FaultOptoNC.SchDoc]

### Parts
K2  CPC1114N  [SOP254P610X206-4N]
LED7  GREEN  [LED0805]
R86  1K 1%  [R0805]
R87  680 1%  [R0805]

### Ports
FAULT (in), NC1, NC2

### Nets
GND: LED7.1(K) R87.1
FAULT: K2.1 R86.1 ; port FAULT
NC1: K2.4 ; port NC1
NC2: K2.3 ; port NC2
NetK2_2: K2.2 R87.2
NetLED7_2: LED7.2(A) R86.2

### Channels
U_MC3_blocks/U_Fault_Module/U_FaultOptoNC: designators end in _U_MC3_blocks_U_Fault_Module_U_FaultOptoNC#1; ports FAULT=F_Speed1_Open NC1=SPEED1_INa NC2=SPEED1_IN
U_MC3_blocks/U_Fault_Module/U_FaultOptoNC: designators end in _U_MC3_blocks_U_Fault_Module_U_FaultOptoNC#2; ports FAULT=F_TPS_Intermitent NC1=TPS_WIPERa NC2=TPS_WIPER
U_MC3_blocks/U_Fault_Module/U_FaultOptoNC: designators end in _U_MC3_blocks_U_Fault_Module_U_FaultOptoNC#3; ports FAULT=F_Cool_Open NC1=COOL_TEMP_INa NC2=COOL_TEMP_IN

### Notes on the sheet
- Title
- Size:
- Date:
- Letter
- Number:
- Time:
- Revision:
- Sheet
- of
- Fluid Power Training
- Institute Inc.
- 2170 S 3040 W
- Salt Lake City, 84119,UT.
- United States.
- File:
- (in symbol CPC1114N) NC

### Library data of the parts
K2 = CPC1114N: SINGLE-POLE, NORMALLY CLOSED4-LEAD SOP OPTOMOS RELAY; Manufacturer: Ixys Clare; Supplier 1: Mouser; Supplier Part Number 1: 849-CPC1114N; Manufacturer Part Number: CPC1114N; RoHS: Yes; Category: Solid State Relays; Stock 1: 6476; Pricing 1: 1=1.34000, 10=1.26000, 20=1.12000, 50=1.06000, 100=1.00000, 200=0.89600 (USD); Case/Package: SOP; Package Quantity: 100; Radiation Hardening: No; ComponentLink1URL: https://datasheet.ciiva.com/15261/cpc1114n-15261697.pdf?src-supplier=Arrow+Europe; ComponentLink1Description: https://datasheet.ciiva.com/15261/cpc1114n-15261697.pdf?src-supplier=Arrow+Europe; Lead Free: Lead Free
LED7 = 150080VS75000: as LED3 on sheet FaultRelay; Supplier 1: Mouser; Supplier Part Number 1: 710-150080VS75000; Manufacturer Part Number: 150080VS75000; RoHS: Yes; Category: LEDs; Stock 1: 16574; Pricing 1: 1=0.18000, 10=0.17500, 25=0.17400, 50=0.16200, 100=0.13900, 250=0.12300 (USD); Mount: Surface Mount; Case/Package: 0805; Color: Green; Case Code (Metric): 2012; Case Code (Imperial): 0805; Min Operating Temperature: -40°C; Max Operating Temperature: 85°C; Packaging: Tape and Reel; Package Quantity: 4000; Wavelength: 570nm; Length: 2mm; Height: 0.7mm; Width: 1.25mm; REACH SVHC: Unknown; ComponentLink1URL: https://datasheet.ciiva.com/22656/150080vs75000-22656966.pdf?src-supplier=Element14; ComponentLink1Description: https://datasheet.ciiva.com/22656/150080vs75000-22656966.pdf?src-supplier=Element14; ComponentLink2URL: https://datasheet.ciiva.com/29279/759437-da-01-en-chipled-0805-w-kl-h-gruen-150080vs7500-29279047.pdf?src-supplier=Conrad; ComponentLink2Description: https://datasheet.ciiva.com/29279/759437-da-01-en-chipled-0805-w-kl-h-gruen-150080vs7500-29279047.pdf?src-supplier=Conrad; ComponentLink3URL: https://datasheet.ciiva.com/29563/150080vs75000-29563018.pdf?src-supplier=Digi-Key; ComponentLink3Description: https://datasheet.ciiva.com/29563/150080vs75000-29563018.pdf?src-supplier=Digi-Key
R86 = RC0805FR-071KL: RESISTOR, 0805 1K 1%, FULL REEL; Product Range:YAGEO - RC Series; Resistance:1kohm; Power Rating:125mW; Resistance Tolerance:± 1%; Resistor Case Style:0805 [2012 Metric]; Resistor Element Material:Thick Film; Temperature Coefficient:± 250ppm/°C; Voltage Rating:150V; Packaging:Tape & Reel; MSL:-; SVHC:No SVHC (16-Dec-2013); External Depth:0.55mm; External Length / Height:2mm; External Width:1.25mm; No. of Pins:2; Operating Temperature Max:155°C; Operating Temperature Min:-55°C; Operating Temperature Range:-55°C to +155°C; Reel Quantity:5000; Resistor Mounting:SMD; Series:RC12H; Temperature Coef; Manufacturer: Yageo; Resistance: 1kR; Temperature Coefficient: 100ppm/°C; Power Rating: 125mW; Voltage Rating: 150V; Supplier 1: Mouser; Manufacturer Part Number: RC0805FR-071KL; RoHS: Yes; Stock 1: 1519412; Pricing 1: 1=0.13000, 10=0.03100, 100=0.01100, 1000=0.00800, 5000=0.00500, 10000=0.00500 (USD); ComponentLink1URL: https://datasheet.ciiva.com/2456/pyu-r-int-thick-7-2456976.pdf?src-supplier=Digi-Key; ComponentLink1Description: https://datasheet.ciiva.com/2456/pyu-r-int-thick-7-2456976.pdf?src-supplier=Digi-Key; ComponentLink2URL: https://datasheet.ciiva.com/2456/pyu-r-int-thick-7-2456977.pdf?src-supplier=Digi-Key; ComponentLink2Description: https://datasheet.ciiva.com/2456/pyu-r-int-thick-7-2456977.pdf?src-supplier=Digi-Key; Supplier Part Number 1: 603-RC0805FR-071KL; Category: Chip SMD Resistors; Case/Package: 0805; Case Code (Imperial): 0805; Case Code (Metric): 2012; Min Operating Temperature: -55°C; Max Operating Temperature: 155°C; Tolerance: 1%; Packaging: Tape and Reel; Composition: Thick Film; Termination: SMD/SMT; Voltage Rating (DC): 150V; Package Quantity: 1; Military Standard: Not; Length: 0.079inch; Height: 0.024inch; Width: 0.049inch; Depth: 1.25mm; Lead Free: Lead Free; REACH SVHC: Unknown; ComponentLink3URL: https://datasheet.ciiva.com/7941/1686128-7941719.pdf?src-supplier=Element14; ComponentLink3Description: https://datasheet.ciiva.com/7941/1686128-7941719.pdf?src-supplier=Element14; ComponentLink4URL: https://datasheet.ciiva.com/16850/rc0805-16850409.pdf?src-supplier=Future+Electronics; ComponentLink4Description: https://datasheet.ciiva.com/16850/rc0805-16850409.pdf?src-supplier=Future+Electronics; ComponentLink5URL: https://datasheet.ciiva.com/46385/444164-46385020.pdf?src-supplier=Element14; ComponentLink5Description: https://datasheet.ciiva.com/46385/444164-46385020.pdf?src-supplier=Element14; ComponentLink6URL: https://datasheet.ciiva.com/2456/pyu-r-int-thick-7-2456975.pdf?src-supplier=Digi-Key; ComponentLink6Description: https://datasheet.ciiva.com/2456/pyu-r-int-thick-7-2456975.pdf?src-supplier=Digi-Key; Number of Pins: 2; Number of Terminations: 2; Max Power Dissipation: 125mW; Features: Moisture Resistant
R87 = ERJ6ENF6800V: 680 ohm, 125 mW,  1%, 150 V,PANASONIC ELECTRONIC COMPONENTS         ERJ6ENF6800V            Surface Mount Chip Resistor, Thick Film, AEC-Q200 ERJ6E Series,; Resistance: 680R; Temperature Coefficient: 100ppm/°C; Power Rating: 125mW; Voltage Rating: 150V; Supplier 1: Mouser; Supplier Part Number 1: 667-ERJ-6ENF6800V; Manufacturer: Panasonic; Manufacturer Part Number: ERJ6ENF6800V; RoHS: Yes; Category: Chip SMD Resistors; Stock 1: 59996; Pricing 1: 1=0.11000, 10=0.07200, 100=0.02800, 1000=0.01900, 5000=0.01700, 10000=0.01500 (USD); Mount: Surface Mount; Case/Package: 0805; Number of Pins: 2; Case Code (Metric): 2012; Case Code (Imperial): 0805; Contact Plating: Tin; Min Operating Temperature: -55°C; Max Operating Temperature: 155°C; Packaging: Tape and Reel; Tolerance: 1%; Composition: Thick Film; Termination: SMD/SMT; Number of Terminations: 2; Max Power Dissipation: 125mW; Package Quantity: 1; Features: Automotive AEC-Q200; Military Standard: Not; Length: 2mm; Height: 0.6mm; Width: 0.049inch; Depth: 1.25mm; Radiation Hardening: No; REACH SVHC: No SVHC; ComponentLink1URL: https://datasheet.ciiva.com/11821/0900766b80f80784-11821688.pdf?src-supplier=RSComponents; ComponentLink1Description: https://datasheet.ciiva.com/11821/0900766b80f80784-11821688.pdf?src-supplier=RSComponents; ComponentLink2URL: https://datasheet.ciiva.com/16787/70260748-16787589.pdf?src-supplier=Allied+Electronics; ComponentLink2Description: https://datasheet.ciiva.com/16787/70260748-16787589.pdf?src-supplier=Allied+Electronics; ComponentLink3URL: https://datasheet.ciiva.com/9180/aoa0000ce2-9180429.pdf?src-supplier=Avnet; ComponentLink3Description: https://datasheet.ciiva.com/9180/aoa0000ce2-9180429.pdf?src-supplier=Avnet; ComponentLink4URL: https://datasheet.ciiva.com/7944/426256-7944661.pdf?src-supplier=Element14; ComponentLink4Description: https://datasheet.ciiva.com/7944/426256-7944661.pdf?src-supplier=Element14; ComponentLink5URL: https://datasheet.ciiva.com/16512/aoa0000ce2-16512058.pdf?src-supplier=Avnet+Asia; ComponentLink5Description: https://datasheet.ciiva.com/16512/aoa0000ce2-16512058.pdf?src-supplier=Avnet+Asia; ComponentLink6URL: https://datasheet.ciiva.com/16757/70260748-16757933.pdf?src-supplier=Allied+Electronics; ComponentLink6Description: https://datasheet.ciiva.com/16757/70260748-16757933.pdf?src-supplier=Allied+Electronics; ComponentLink7URL: https://datasheet.ciiva.com/30107/aoa0000ce2-30107005.pdf?src-supplier=Onlinecomponents.com; ComponentLink7Description: https://datasheet.ciiva.com/30107/aoa0000ce2-30107005.pdf?src-supplier=Onlinecomponents.com; ComponentLink8URL: https://datasheet.ciiva.com/46373/1678782-46373887.pdf?src-supplier=Element14; ComponentLink8Description: https://datasheet.ciiva.com/46373/1678782-46373887.pdf?src-supplier=Element14; ComponentLink9URL: https://datasheet.ciiva.com/17205/aoa0000ce2-17205287.pdf?src-supplier=Avnet+Europe; ComponentLink9Description: https://datasheet.ciiva.com/17205/aoa0000ce2-17205287.pdf?src-supplier=Avnet+Europe; ComponentLink10URL: https://datasheet.ciiva.com/7944/426256-7944953.pdf?src-supplier=Element14; ComponentLink10Description: https://datasheet.ciiva.com/7944/426256-7944953.pdf?src-supplier=Element14; ComponentLink11URL: https://datasheet.ciiva.com/5860/426256-5860698.pdf?src-supplier=Farnell; ComponentLink11Description: https://datasheet.ciiva.com/5860/426256-5860698.pdf?src-supplier=Farnell; ComponentLink12URL: https://datasheet.ciiva.com/46373/1678782-46373886.pdf?src-supplier=Element14; ComponentLink12Description: https://datasheet.ciiva.com/46373/1678782-46373886.pdf?src-supplier=Element14